# EAGLE design inversor (EAGLE 9.6.2)
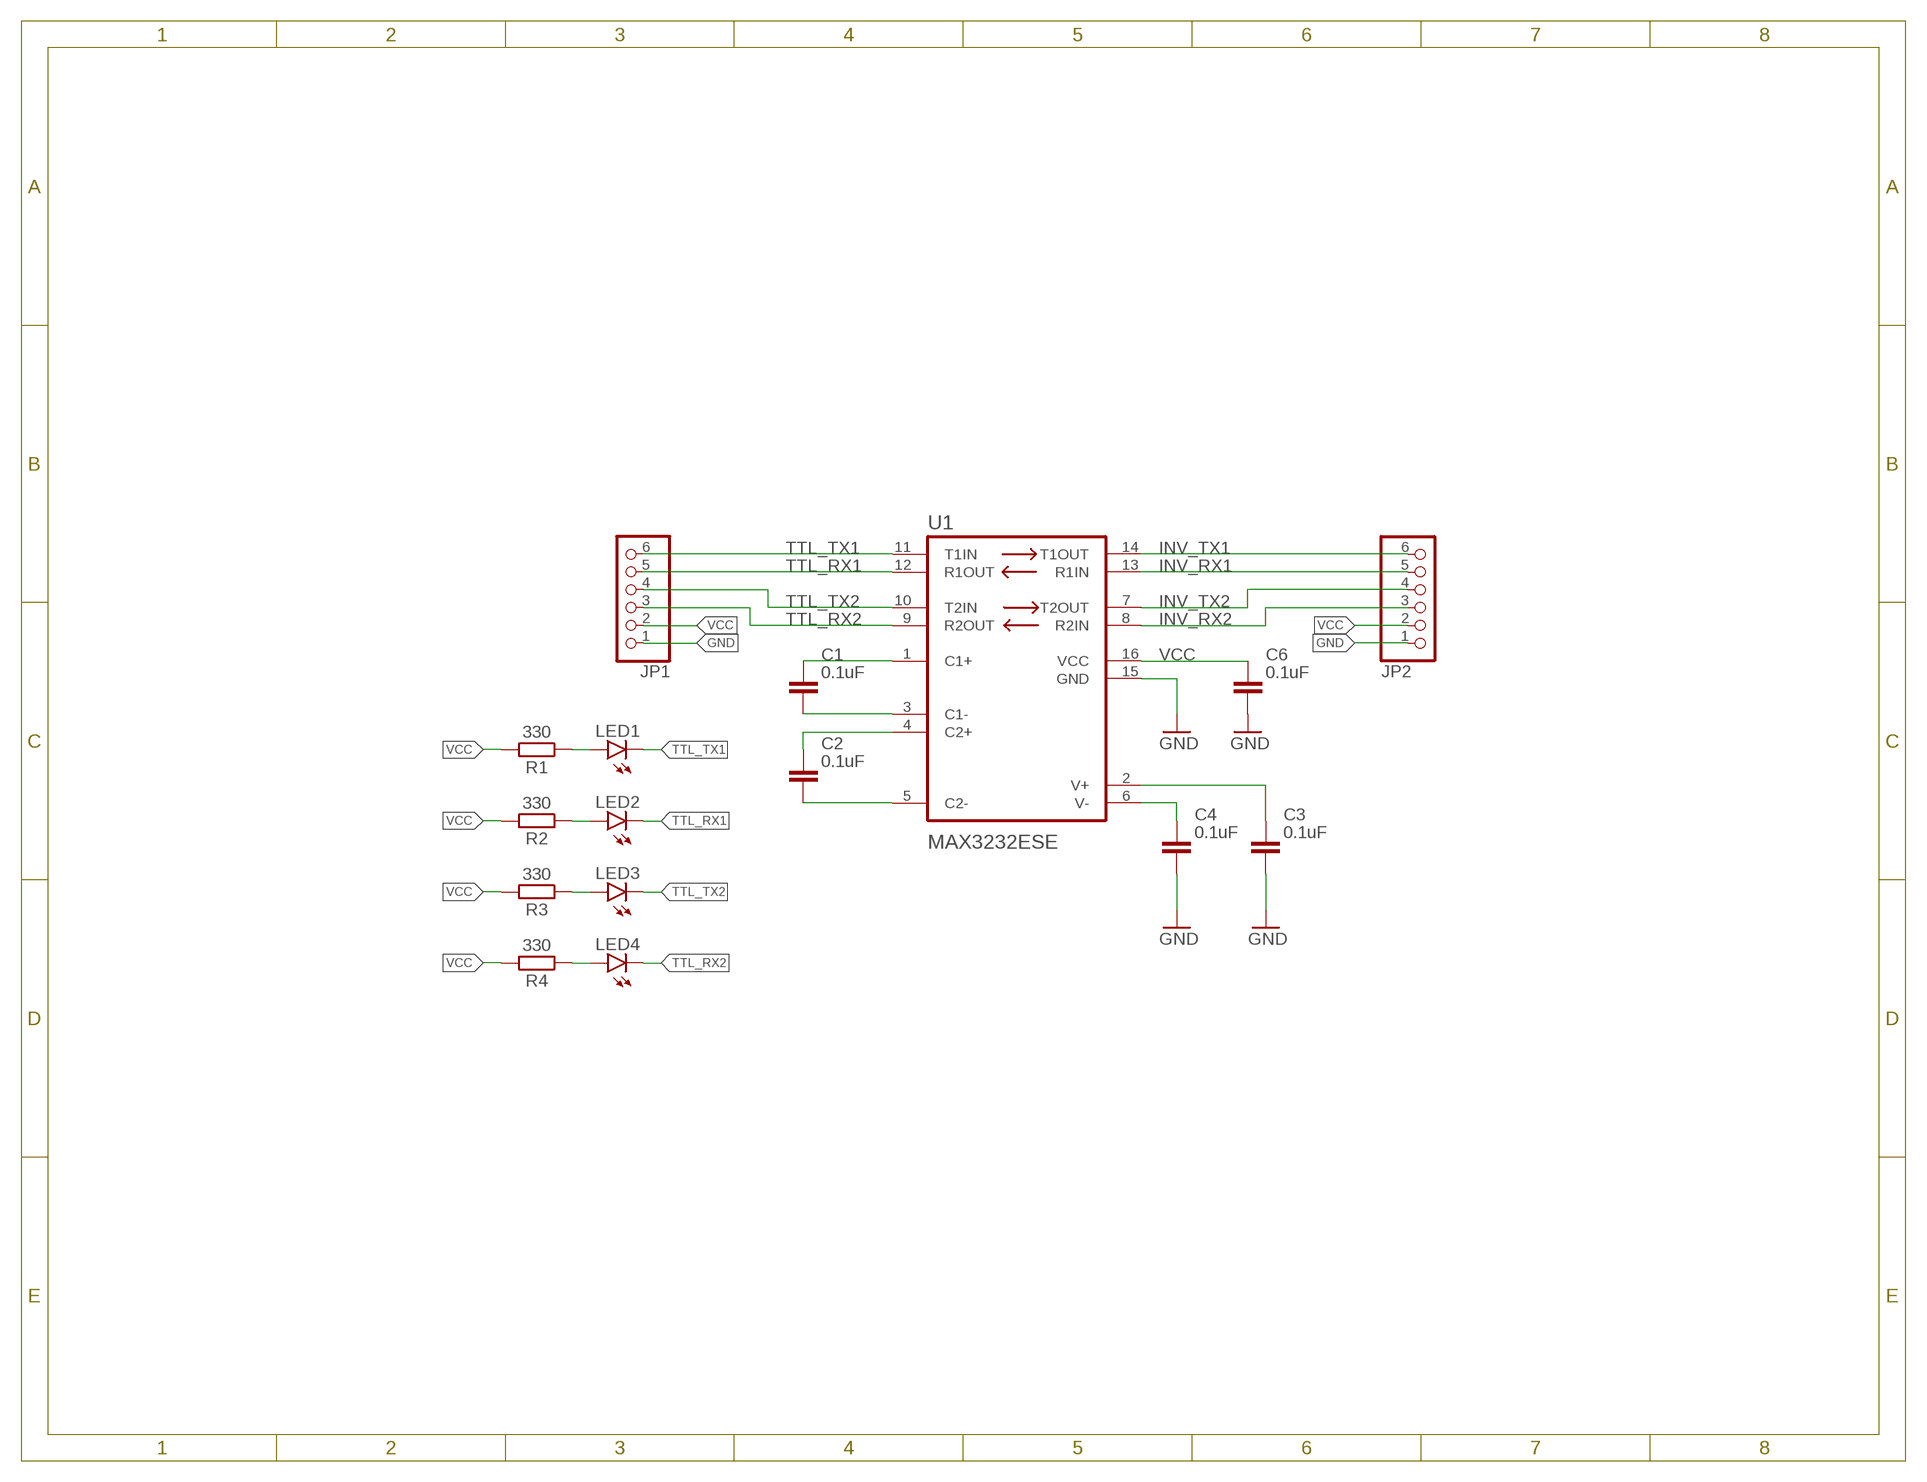
[diagram p0: schematic, sheet 1]

## Parts
C1  0.1uF  C_CHIP-0603(1608-METRIC)  [CAPC1608X85]
C2  0.1uF  C_CHIP-0603(1608-METRIC)  [CAPC1608X85]
C3  0.1uF  C_CHIP-0603(1608-METRIC)  [CAPC1608X85]
C4  0.1uF  C_CHIP-0603(1608-METRIC)  [CAPC1608X85]
C6  0.1uF  C_CHIP-0603(1608-METRIC)  [CAPC1608X85]
JP1  PINHD-1X6  [1X06]
JP2  PINHD-1X6  [1X06]
LED1  LED  LEDCHIPLED_0805  [CHIPLED_0805]
LED2  LED  LEDCHIPLED_0805  [CHIPLED_0805]
LED3  LED  LEDCHIPLED_0805  [CHIPLED_0805]
LED4  LED  LEDCHIPLED_0805  [CHIPLED_0805]
R1  330  R_CHIP-0603(1608-METRIC)  [RESC1608X60]
R2  330  R_CHIP-0603(1608-METRIC)  [RESC1608X60]
R3  330  R_CHIP-0603(1608-METRIC)  [RESC1608X60]
R4  330  R_CHIP-0603(1608-METRIC)  [RESC1608X60]
U1  MAX3232ESE  [SOIC127P600X175-16N]

## Nets
GND: C3.2 C4.2 C6.2 JP1.1 JP2.1 U1.15(GND)
INV_RX1: JP2.5 U1.13(R1IN)
INV_RX2: JP2.3 U1.8(R2IN)
INV_TX1: JP2.6 U1.14(T1OUT)
INV_TX2: JP2.4 U1.7(T2OUT)
MAX_C1+: C1.1 U1.1(C1+)
MAX_C1-: C1.2 U1.3(C1-)
MAX_C2+: C2.1 U1.4(C2+)
MAX_C2-: C2.2 U1.5(C2-)
MAX_V+: C3.1 U1.2(V+)
MAX_V-: C4.1 U1.6(V-)
N$1: LED1.A R1.1
N$2: LED2.A R2.1
N$3: LED3.A R3.1
N$9: LED4.A R4.1
TTL_RX1: JP1.5 LED2.C U1.12(R1OUT)
TTL_RX2: JP1.3 LED4.C U1.9(R2OUT)
TTL_TX1: JP1.6 LED1.C U1.11(T1IN)
TTL_TX2: JP1.4 LED3.C U1.10(T2IN)
VCC: C6.1 JP1.2 JP2.2 R1.2 R2.2 R3.2 R4.2 U1.16(VCC)

## Library data of the parts
C1-C4 C6 = Capacitor:C: Capacitor - Generic; CATEGORY: Capacitor; LCSC: C14663
JP1 JP2 = pinhead:PINHD-1X6: PIN HEADER
LED1-LED4 = led:LED: LED OSRAM: - CHIPLED LG R971, LG N971, LY N971, LG Q971, LY Q971, LO R971, LY R971 LH N974, LH R974 LS Q976, LO Q976, LY Q976 LO Q996 - Hyper CHIPLED LW Q18S LB Q993, LB Q99A, LB R99A - SideLED LS A670, LO A670, LY A670, LG A670, LP A670 LB A673, LV A673, LT A673, LW A673 LH A674 LY A675 LS A676, LA A676, LO A676, LY A676, LW A676 LS A679, LY A679, LG A679 - Hyper Micro SIDELED® LS Y876, LA Y876, LO Y876, LY Y876 LT Y87S - SmartLED LW L88C, LW L88S LB L89C, LB L89S, LG L890 LS L89K, LO L89K, LY L89K LS L896, LA L896, LO L896, LY L896 - TOPLED LS T670, LO T670, LY T670, LG T670, LP T670 LSG T670, LSP T670, LSY T670, LOP T670, LYG T670 LG T671, LOG T671, LSG T671 LB T673, LV T673, LT T673, LW T673 LH T674 LS T676, LA T676, LO T676, LY T676, LB T676, LH T676, LSB T676, LW T676 LB T67C, LV T67C, LT T67C, LS T67K, LO T67K, LY T67K, LW E67C LS E67B, LA E67B, LO E67B, LY E67B, LB E67C, LV E67C, LT E67C LW T67C LS T679, LY T679, LG T679 LS T770, LO T770, LY T770, LG T770, LP T770 LB T773, LV T773, LT T773, LW T773 LH T774 LS E675, LA E675, LY E675, LS T675 LS T776, LA T776, LO T776, LY T776, LB T776 LHGB T686 LT T68C, LB T68C - Hyper Mini TOPLED® LB M676 - Mini TOPLED Santana® LG M470 LS M47K, LO M47K, LY M47K Source: http://www.osram.convergy.de LUXEON: - LUMILED® LXK2-PW12-R00, LXK2-PW12-S00, LXK2-PW14-U00, LXK2-PW14-V00 LXK2-PM12-R00, LXK2-PM12-S00, LXK2-PM14-U00 LXK2-PE12-Q00, LXK2-PE12-R00, LXK2-PE12-S00, LXK2-PE14-T00, LXK2-PE14-U00 LXK2-PB12-K00, LXK2-PB12-L00, LXK2-PB12-M00, LXK2-PB14-N00, LXK2-PB14-P00, LXK2-PB14-Q00 LXK2-PR12-L00, LXK2-PR12-M00, LXK2-PR14-Q00, LXK2-PR14-R00 LXK2-PD12-Q00, LXK2-PD12-R00, LXK2-PD12-S00 LXK2-PH12-R00, LXK2-PH12-S00 LXK2-PL12-P00, LXK2-PL12-Q00, LXK2-PL12-R00 Source: www.luxeon.com KINGBRIGHT: KA-3528ASYC Source: www.kingbright.com; LCSC: C2296; MF: baizou; MP: BZ-C0805-B3-E1; PACKAGE: 0805
R1-R4 = Resistor:R: Resistor Fixed - Generic; CATEGORY: Resistor; LCSC: C23138; SUB-CATEGORY: Fixed
U1 = MAX3232ESE:MAX3232ESE: Check availability <https://pricing.snapeda.com/parts/MAX3232ESE/Maxim%20Integrated/view-part?ref=eda>; AVAILABILITY: In Stock; DESCRIPTION: 2/2 Transceiver Full RS232 16-SOIC; LCSC: C2904738; MF: Maxim Integrated; MP: MAX3232ESE+T; PACKAGE: SOIC-16_3.9x9.9x1.27P; PRICE: None; PURCHASE-URL: https://pricing.snapeda.com/search/part/MAX3232ESE/?ref=eda

## Board
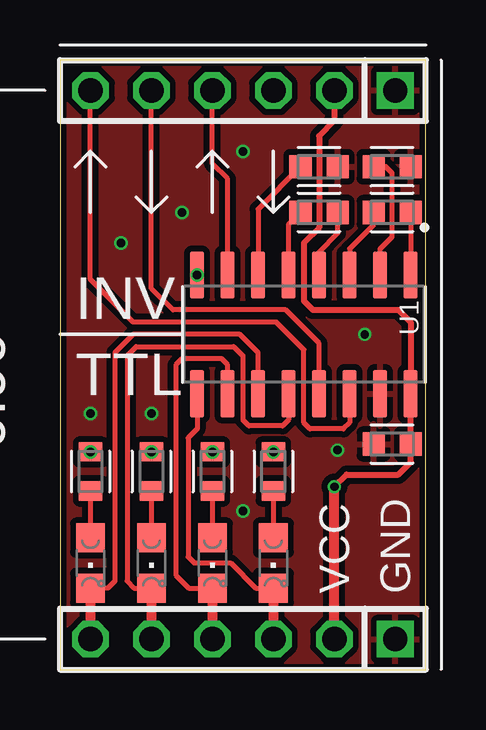
[diagram p1: board, top side]
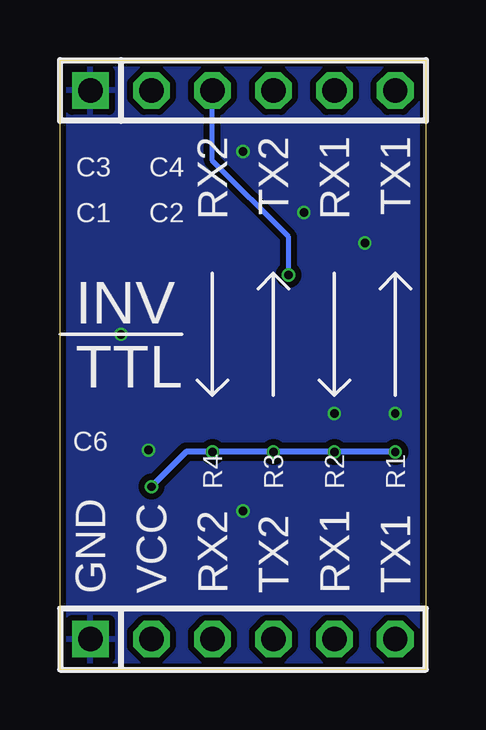
[diagram p2: board, bottom side, seen from below]

Size 15.24 x 25.4 mm. Coordinates in mm from the lower left corner, seen from the top.
Outline: 0,0 15.24,0 15.24,25.4 0,25.4 0,0
Copper layers (1*16): Top 0.035mm / dielectric 0.2mm / Bottom 0.035mm
Design rules "jlcpcb-2-layer": minimum track width 3.5mil, minimum drill 0.2mm, track to track 3.5mil, track to pad 5mil, pad to pad 5mil, via to via 5mil, smd to smd 0mil, copper to edge 0.1mm, drill to drill 5mil, minimum pad ring 4mil, minimum via ring 4mil, stop-mask expansion 3mil, vias tented up to drill 100mil, thermal gap 10mil

### Footprints (pad centres in the part's own frame; a part is rotated, then mirrored left to right if it is on the bottom)
CAPC1608X85 = smd 0.921 x 0.97: 1 -0.775,0; 2 0.775,0
1X06 = drill 1.016 square: 1 -6.35,0 | drill 1.016 octagon: 2 -3.81,0; 3 -1.27,0; 4 1.27,0; 5 3.81,0; 6 6.35,0
CHIPLED_0805 = smd 1.2 x 1.2: A 0,-1.05; C 0,1.05
RESC1608X60 = smd 0.799 x 0.974: 1 -0.815,0; 2 0.815,0
SOIC127P600X175-16N = smd 1.97 x 0.59: 1 -2.475,4.445; 2 -2.475,3.175; 3 -2.475,1.905; 4 -2.475,0.635; 5 -2.475,-0.635; 6 -2.475,-1.905; 7 -2.475,-3.175; 8 -2.475,-4.445; 9 2.475,-4.445; 10 2.475,-3.175; 11 2.475,-1.905; 12 2.475,-0.635; 13 2.475,0.635; 14 2.475,1.905; 15 2.475,3.175; 16 2.475,4.445

### Placement (x,y rotation side)
C1  13.84,19.05 180 top
C2  10.79,19.05 180 top
C3  13.84,20.95 0 top
C4  10.79,20.95 0 top
C6  13.84,9.4 180 top
JP1  7.62,1.27 180 top
JP2  7.62,24.13 180 top
LED1  1.27,4.45 180 top
LED2  3.81,4.45 180 top
LED3  6.35,4.45 180 top
LED4  8.89,4.45 180 top
R1  1.27,8.26 90 top
R2  3.81,8.26 90 top
R3  6.35,8.26 90 top
R4  8.89,8.26 90 top
U1  10.16,13.97 270 top

### Tracks (layer width: path | path; a pad name or v marks a point on that pad's centre or on a via)
GND  (via drill 0.35)
  other vias: 3.81,10.67 12.7,13.97 1.27,10.67 2.54,17.78 5.08,19.05 7.62,21.59 7.62,6.6 11.56,9.14
  pour Top (isolate 0.254): -1.27,-1.27 -1.27,26.67 16.51,26.67 16.51,-1.27
  pour Bottom (isolate 0.254): -1.27,-1.27 -1.27,26.67 16.51,26.67 16.51,-1.27
INV_RX1
  Top 0.203: U1.13 10.79,13.59 9.4,14.99 4.7,14.99 3.81,15.88 JP2.5
INV_RX2  (via drill 0.35)
  Bottom 0.203: U1.8 5.71,18.03 8.89,21.21 JP2.3
  other vias: 5.71,16.45
INV_TX1
  Top 0.203: U1.14 12.06,10.29 11.81,10.03 10.41,10.03 10.16,10.29 10.16,13.34 9.02,14.48 3.05,14.48 1.27,16.26 JP2.6
INV_TX2
  Top 0.203: U1.7 6.99,20.45 6.35,21.08 JP2.4
MAX_C1+
  Top 0.2: C1.1 14.61,19.04
  Top 0.203: 14.61,19.04 U1.1
MAX_C1-
  Top 0.2: C1.2 13.07,18.54 | 12.06,17.54 U1.3
  Top 0.203: 13.07,18.54 12.06,17.54
MAX_C2+
  Top 0.2: U1.4 10.79,17.4
  Top 0.203: C2.1 11.57,18.17 10.79,17.4
MAX_C2-
  Top 0.203: U1.5 9.53,18.55 C2.2
MAX_V+
  Top 0.2: U1.2 13.34,17.53 | C3.1 13.58,20.95 13.84,20.69 13.84,18.03
  Top 0.203: 13.34,17.53 13.84,18.03
MAX_V-
  Top 0.203: C4.1 8.26,19.19 U1.6
N$1
  Top 0.203: R1.1 LED1.A
N$2
  Top 0.203: R2.1 LED2.A
N$3
  Top 0.203: R3.1 LED3.A
N$9
  Top 0.203: R4.1 LED4.A
TTL_RX1
  Top 0.203: U1.12 9.53,10.41 9.27,10.16 7.87,10.16 7.62,10.41 7.62,13.08 7.24,13.46 3.17,13.46 2.79,13.08 2.79,3.68 3.08,3.4 LED2.C
  Top 0.406: LED2.C JP1.5
TTL_RX2
  Top 0.203: U1.9 5.71,10.03 5.33,9.65 5.33,4.7 5.59,4.45 7.11,4.45 8.16,3.4 LED4.C
  Top 0.406: LED4.C JP1.3
TTL_TX1
  Top 0.203: U1.11 8.26,13.21 7.49,13.97 3.05,13.97 2.29,13.21 2.29,3.68 2,3.4 LED1.C
  Top 0.406: LED1.C JP1.6
TTL_TX2
  Top 0.203: U1.10 6.99,12.7 6.73,12.95 5.08,12.95 4.83,12.7 4.83,3.94 5.37,3.4 LED3.C
  Top 0.406: LED3.C JP1.4
VCC  (via drill 0.35)
  Top 0.254: v11.43,7.62 11.94,8.13 14.1,8.13 14.62,8.65 C6.1 14.61,9.41 U1.16 14.61,14.48 14.1,14.99 10.54,14.99 10.16,15.37 10.16,17.78 10.79,18.41 10.79,22.23 11.43,22.86 JP2.2
  Top 0.406: JP1.2 v11.43,7.62
  Bottom 0.254: R1.2 R2.2 R3.2 R4.2 9.98,9.07 v11.43,7.62
  other vias: 1.27,9.07 3.81,9.07 6.35,9.07 8.89,9.07

### Text on the board
tPlace: 0.60" | INV | 0.90" | 1.00" | TTL | VCC | GND
bPlace: RX2 / TX2 / RX1 / TX1 | INV / TTL | GND / VCC / RX2 / TX2 / RX1 / TX1